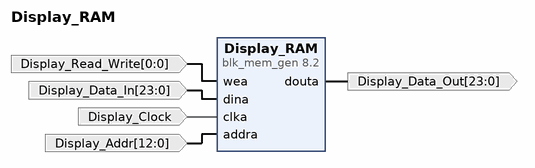
[diagram p0: block diagram of the top level]
# Vivado block design Display_RAM, Vivado 2014.4
create_bd_design Display_RAM

create_bd_port -dir I -from 0 -to 0 Display_Read_Write
create_bd_port -dir O -from 23 -to 0 Display_Data_Out
create_bd_port -dir I -from 23 -to 0 Display_Data_In
create_bd_port -dir I Display_Clock
create_bd_port -dir I -from 12 -to 0 Display_Addr

create_bd_cell -type ip -vlnv xilinx.com:ip:blk_mem_gen:8.2 Display_RAM
set_property -dict [list \
  CONFIG.Enable_32bit_Address false \
  CONFIG.Use_Byte_Write_Enable false \
  CONFIG.Write_Width_A 24 \
  CONFIG.Read_Width_A 24 \
  CONFIG.Enable_A Always_Enabled \
  CONFIG.Register_PortA_Output_of_Memory_Primitives true \
  CONFIG.Use_RSTA_Pin false \
  CONFIG.use_bram_block Stand_Alone \
] [get_bd_cells Display_RAM]

# ---- connections ----

connect_bd_net -net wea_1 [get_bd_ports Display_Read_Write] [get_bd_pins Display_RAM/wea]
connect_bd_net [get_bd_pins Display_RAM/douta] [get_bd_ports Display_Data_Out]
connect_bd_net -net dina_1 [get_bd_ports Display_Data_In] [get_bd_pins Display_RAM/dina]
connect_bd_net -net clka_1 [get_bd_ports Display_Clock] [get_bd_pins Display_RAM/clka]
connect_bd_net -net addra_1 [get_bd_ports Display_Addr] [get_bd_pins Display_RAM/addra]

validate_bd_design
save_bd_design
